# EAGLE design AC-DC 3.3V Power Supply (EAGLE 6.3)
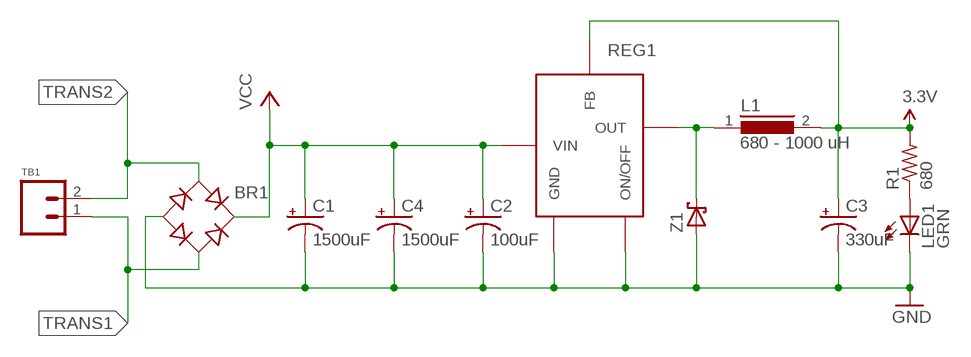
[diagram p0: schematic, sheet 1]

## Parts
BR1  BR  [DFS]
C1  1500uF  CAP_POLJ16  [J16_CAP]
C2  100uF  CAP_POLF  [F_CAP]
C3  330uF  CAP_POLF  [F_CAP]
C4  1500uF  CAP_POLJ16  [J16_CAP]
L1  680 - 1000 uH  DR125  [DR125]
LED1  GRN  LED0603  [0603_LED]
R1  680  RESISTOR0603  [0603_RESISTOR]
REG1  TL2575  [TO-263-6]
TB1  TERMINAL_BLOCK_2  [TERMINAL_BLOCK_2]
Z1  SCHOTTKY_DIODE  [SMD_DIODE]

## Nets
3.3V: C3.+ L1.2 R1.2 REG1.4(FB)
GND: BR1.- C1.- C2.- C3.- C4.- LED1.C REG1.3(GND) REG1.5(ON/OFF) Z1.A
N$1: LED1.A R1.1
N$8: L1.1 REG1.2(OUT) Z1.C
TRANS1: BR1.AC2 TB1.1
TRANS2: BR1.AC1 TB1.2
VCC: BR1.+ C1.+ C2.+ C4.+ REG1.1(VIN)

## Library data of the parts
BR1 = jkf:BR; DIGIKEY#: 641-1425-1-ND; MANF: Comchip Technology; MANF#: DF206ST-G
C1 C4 = jkf:CAP_POL; DIGIKEY#: PCE3466CT-ND
C2 = jkf:CAP_POL; DIGIKEY#: PCE3917CT-ND
C3 = jkf:CAP_POL; DIGIKEY#: PCE3401CT-ND
L1 = jkf:DR125; DIGIKEY#: SRR1208-102KLCT-ND
LED1 = jkf:LED; DIGIKEY#: 516-2493-1-ND; MANF: Avago Technologies; MANF#: HSMG-C191
R1 = jkf:RESISTOR; DIGIKEY#: P680GCT-ND
REG1 = jkf:TL2575; DIGIKEY#: 296-21828-1-ND; MANF: Texas Instruments; MANF#: TL2575-33IKTTR
TB1 = jkf:TERMINAL_BLOCK_2; DIGIKEY#: 277-2072-1-ND; MANF: Phoenix; MANF#: 1771091
Z1 = jkf:SCHOTTKY_DIODE; DIGIKEY#: 1N5819HW-FDICT-ND; MANF: Diodes Inc; MANF#: 1N5819HW-7-F

## Board
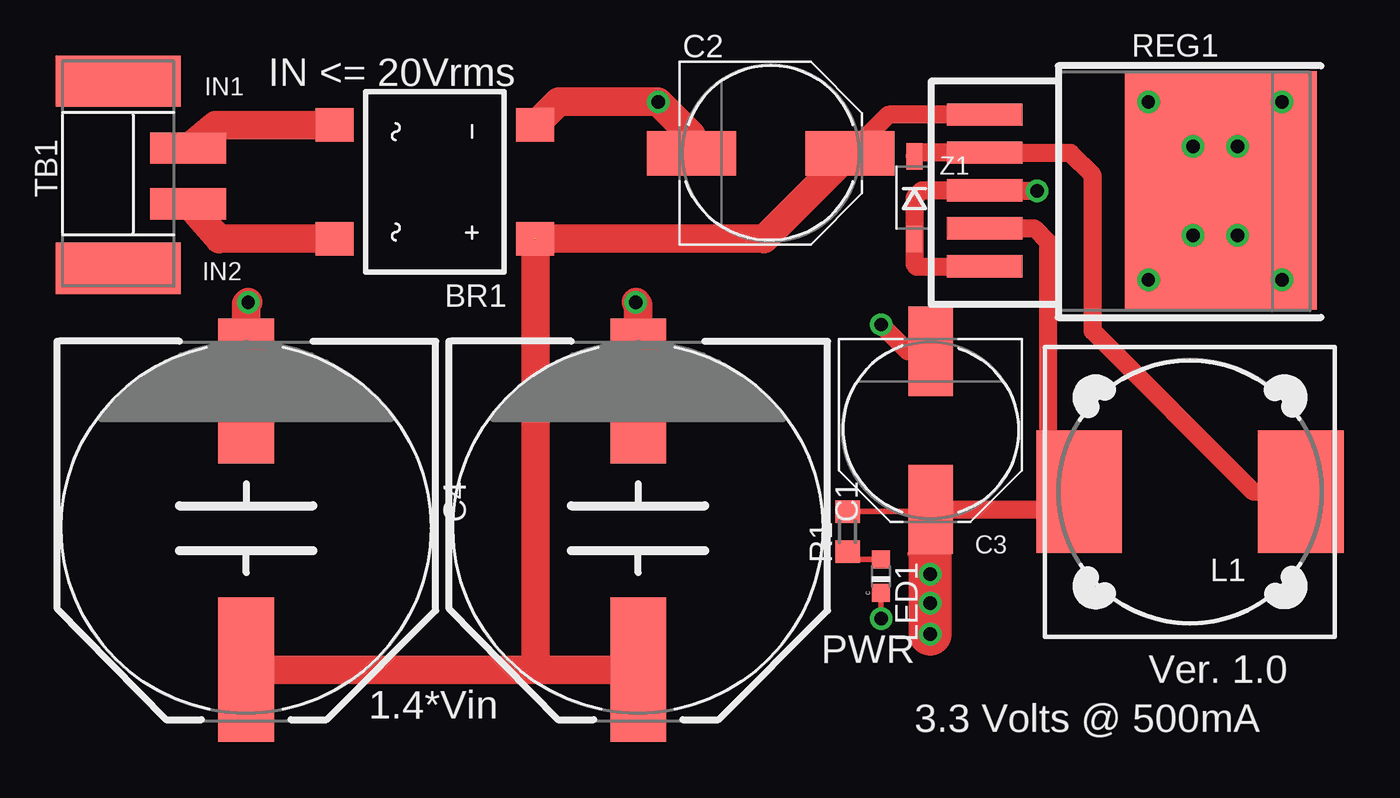
[diagram p1: board, top side]
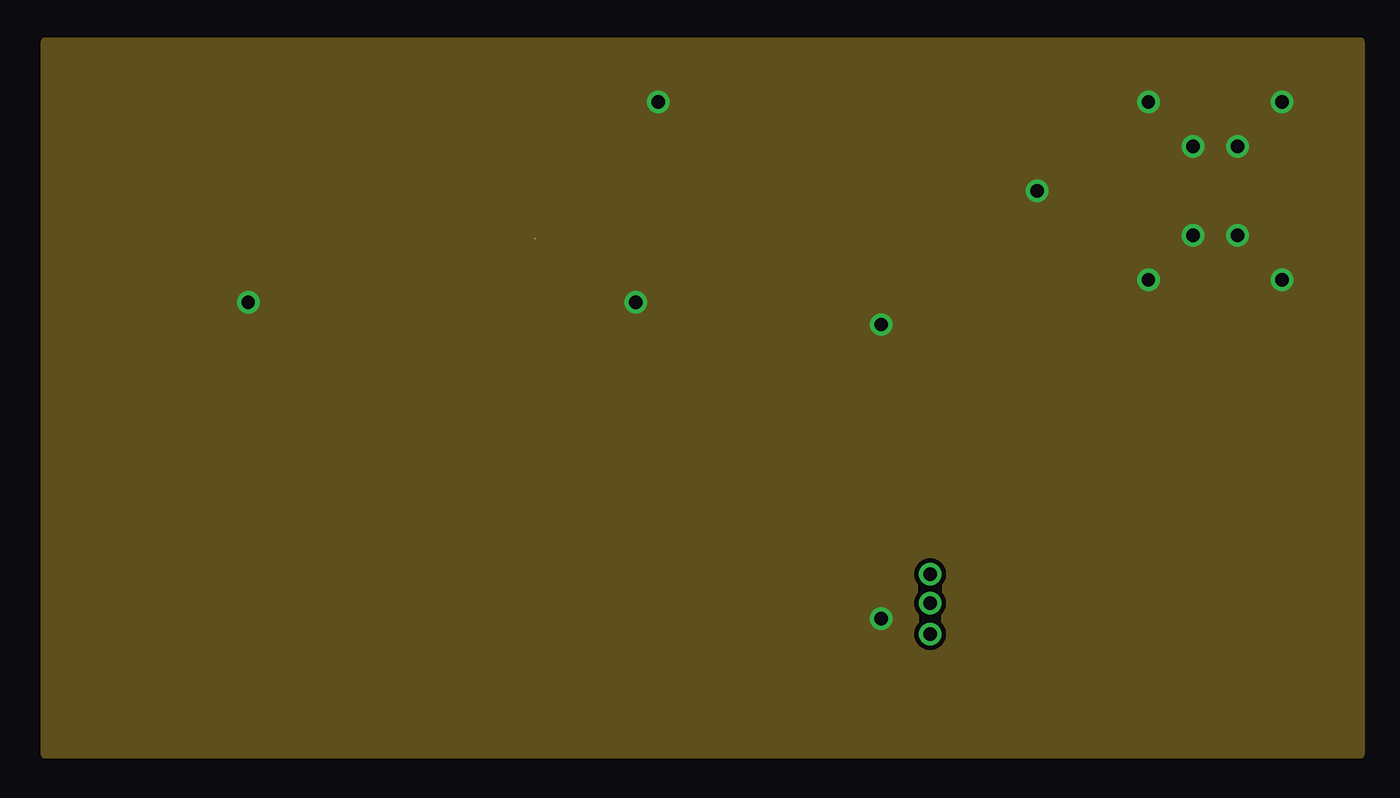
[diagram p2: board, inner layer Route2]
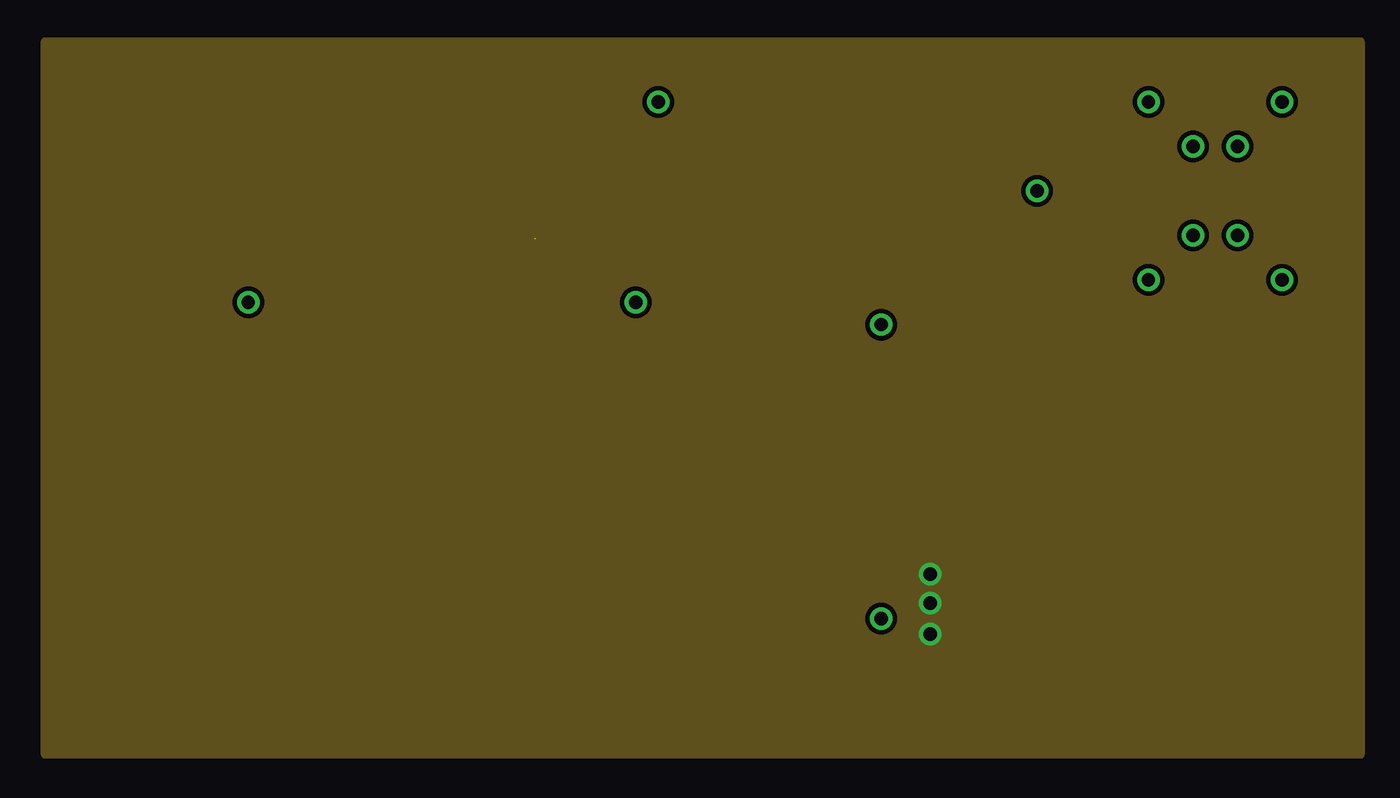
[diagram p3: board, inner layer Route15]

No outline drawn. Coordinates in mm, seen from the top.
Copper layers (1*16): Top 0.035mm / dielectric 1.5mm / Bottom 0.035mm
Design rules "default": minimum track width 10mil, minimum drill 24mil, track to track 8mil, track to pad 8mil, pad to pad 8mil, via to via 8mil, smd to smd 8mil, copper to edge 40mil, drill to drill 8mil, minimum pad ring 10mil, minimum via ring 8mil, stop-mask expansion 4mil, vias tented up to drill 0mil, thermal gap 10mil

### Footprints (pad centres in the part's own frame; a part is rotated, then mirrored left to right if it is on the bottom)
DFS = smd 1.5 x 1.7: + -2.55,-4.5; - 2.55,-4.5; AC1 -2.55,4.5; AC2 2.55,4.5
J16_CAP = smd 6.5 x 2.5: + 6.35,0; - -6.15,0
F_CAP = smd 4 x 2: + 3.55,0; - -3.55,0
DR125 = smd 3.85 x 5.5: 1 -4.975,0; 2 4.975,0
0603_LED = smd 0.8 x 0.8: A -0.75,0; C 0.75,0
0603_RESISTOR = smd 1 x 1.1: 1 -0.9,0; 2 0.9,0
TO-263-6 = smd 1 x 3.4: 1 -3.4,-6.6; 2 -1.7,-6.6; 3 0,-6.6; 4 1.7,-6.6; 5 3.4,-6.6 | smd 10.7 x 8.6: P$1 0,4
TERMINAL_BLOCK_2 = smd 1.4 x 3.4: 1 -1.2,3.15; 2 1.3,3.15 | smd 2.3 x 5.6: P$1 -4.2,0; P$2 4.2,0
SMD_DIODE = smd 1.2 x 0.7: A -1.85,0; C 1.85,0

### Placement (x,y rotation side)
BR1  17.48,25.7 90 top
C1  26.6,10.16 270 top
C2  32.55,26.99 0 top
C3  39.72,14.55 270 top
C4  9.01,10.16 270 top
L1  51.37,11.79 180 top
LED1  37.5,8 270 top
R1  36,10 90 top
REG1  48.75,25.32 270 top
TB1  3.26,26.02 270 top
Z1  39,25 90 top

### Tracks (layer width: path | path; a pad name or v marks a point on that pad's centre or on a via)
3.3V  (via drill 0.6)
  Top 0.254: 38.8,9 v39.7,8.1 | R1.2 39.62,10.9 C3.+
  Top 0.813: C3.+ 45.6,11 L1.2 45,13.19 45,23 44.38,23.62 REG1.4
  Top 1.93: C3.+ 39.7,11 v39.7,8.1 v39.7,5.4
  other vias: 39.7,6.8
  pour Route15: 0,32 59,32 59,0 0,0
GND  (via drill 0.6)
  Top 0.254: LED1.C v37.5,6.1
  Top 0.813: v44.5,25.3 44.5,25.32 REG1.3 39.32,25.32 39,25 Z1.A 39,22 39.1,21.9 41.94,21.9 REG1.5 | C3.- 38.7,18.1 v37.5,19.3
  Top 1.27: C4.- 9.01,20.21 v9.1,20.3 | C1.- 26.6,20.2 v26.5,20.3 | C2.- 29,27.8 v27.5,29.3 23.02,29.3 BR1.-
  other vias: 49.5,29.3 49.5,21.3 55.5,21.3 55.5,29.3 51.5,27.3 51.5,23.3 53.5,23.3 53.5,27.3
  pour Route2: 0,32 59,32 59,0 0,0
N$1
  Top 0.254: R1.1 36.35,8.75 LED1.A
N$8
  Top 0.813: L1.1 54.21,11.79 47,19 47,26 46,27 41.98,27 REG1.2 39.15,27.02 39,26.87 Z1.C
TRANS1
  Top 1.27: TB1.1 7.62,28.23 7.64,28.25 BR1.AC2
TRANS2
  Top 1.27: TB1.2 7.8,23.13 7.83,23.16 BR1.AC1
VCC  (1 unrouted)
  Top 0.813: REG1.1 37.83,28.72 C2.+
  Top 1.27: C4.+ 22,3.81 | 22,3.81 C1.+ | C2.+ 32.24,23.13 32.22,23.16 BR1.+ | 22,23.13 22,3.81

### Text on the board
tPlace: IN1 | IN <= 20Vrms | IN2 | PWR
tSilk: Ver. 1.0 | 1.4*Vin | 3.3 Volts @ 500mA